# EAGLE design cdf-single-driver (EAGLE 7.3.0)
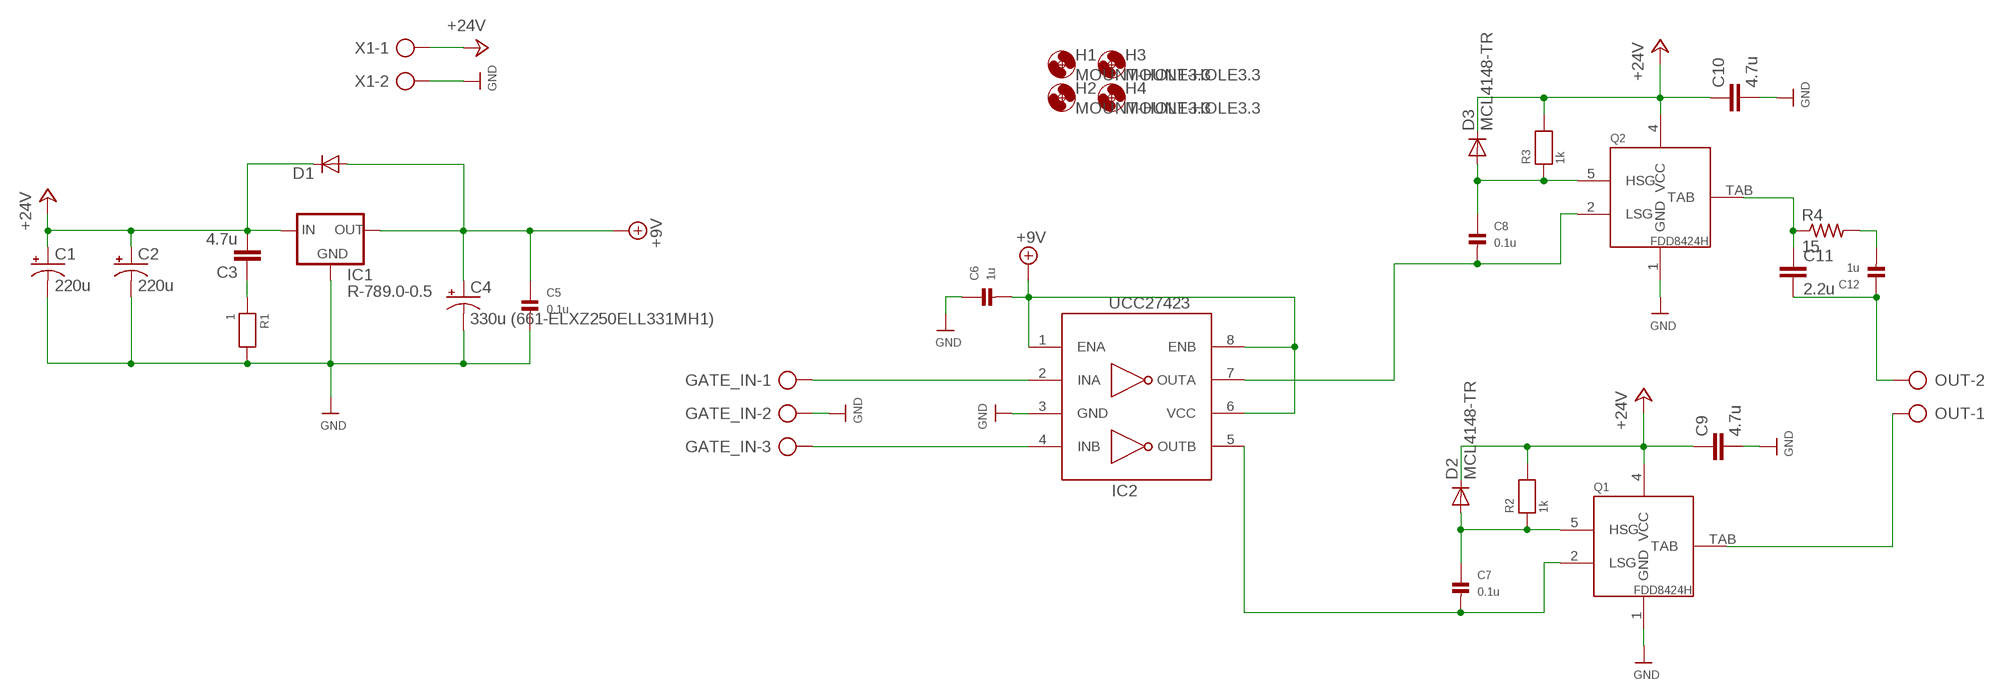
[diagram p0: schematic, sheet 1]

## Parts
C1  220u  CPOL-USE3.5-8  [E3,5-8]
C2  220u  CPOL-USE3.5-8  [E3,5-8]
C3  4.7u  C-EUC1210  [C1210]
C4  330u (661-ELXZ250ELL331MH1)  CPOL-USE3.5-8  [E3,5-8]
C5  0.1u  CAP_CERAMIC0805  [0805]
C6  1u  CAP_CERAMIC1206  [1206]
C7  0.1u  CAP_CERAMIC0805  [0805]
C8  0.1u  CAP_CERAMIC0805  [0805]
C9  4.7u  C-EUC1210  [C1210]
C10  4.7u  C-EUC1210  [C1210]
C11  2.2u  C-EUC1210  [C1210]
C12  1u  CAP_CERAMIC1206  [1206]
D1  DIODE-SOD123  [SOD123]
D2  MCL4148-TR  DIODE-MICROMELF-W  [MICROMELF-W]
D3  MCL4148-TR  DIODE-MICROMELF-W  [MICROMELF-W]
GATE_IN  AK500/3  [AK500/3]
H1  MOUNT-HOLE3.3  [3,3]
H2  MOUNT-HOLE3.3  [3,3]
H3  MOUNT-HOLE3.3  [3,3]
H4  MOUNT-HOLE3.3  [3,3]
IC1  R-789.0-0.5  [SIP3]
IC2  UCC27423  [SOIC8]
OUT  AK500/2  [AK500/2]
Q1  FDD8424H  [TO252-4]
Q2  FDD8424H  [TO252-4]
R1  1  RESISTOR0805  [0805]
R2  1k  RESISTOR0805  [0805]
R3  1k  RESISTOR0805  [0805]
R4  15  R-US_R1210  [R1210]
X1  AK500/2  [AK500/2]

## Nets
+9V: C4.+ C5.1 C6.2 D1.A IC1.3(OUT) IC2.1(ENA) IC2.6(VCC) IC2.8(ENB)
+24V: C1.+ C2.+ C3.2 C9.1 C10.1 D1.C D2.C D3.C IC1.1(IN) Q1.4(VCC) Q2.4(VCC) R2.2 R3.2 X1.1
GND: C1.- C2.- C4.- C5.2 C6.1 C9.2 C10.2 GATE_IN.2 IC1.2(GND) IC2.3(GND) Q1.1(GND) Q2.1(GND) R1.2 X1.2
N$1: GATE_IN.1 IC2.2(INA)
N$2: GATE_IN.3 IC2.4(INB)
N$3: C8.2 IC2.7(OUTA) Q2.2(LSG)
N$4: C8.1 D3.A Q2.5(HSG) R3.1
N$5: C11.1 Q2.TAB R4.1
N$6: C12.2 R4.2
N$7: C11.2 C12.1 OUT.2
N$8: C7.2 IC2.5(OUTB) Q1.2(LSG)
N$9: C7.1 D2.A Q1.5(HSG) R2.1
N$10: OUT.1 Q1.TAB
N$11: C3.1 R1.1

## Library data of the parts
C1 C2 C4 = rcl:CPOL-US: POLARIZED CAPACITOR, American symbol
C3 C9-C11 = rcl:C-EU: CAPACITOR, European symbol
C5-C8 C12 = microbuilder:CAP_CERAMIC: Ceramic Capacitors 0402 - 0402 Surface Mount Capacitors 16pF 50V 5% [Digikey: 445-4899-2-ND] 18pF 50V 5% [Digikey: 490-1281-2-ND] 22pF 50V 5% [Digikey: 490-1283-2-ND] 68pF 50V 5% [Digikey: 490-1289-2-ND] 0.1uF 10V 10% [Digikey: 490-1318-2-ND] 1.0uF 6.3V 10% [Digikey: 490-1320-2-ND] 0603 - 0603 Surface Mount Capacitors 16 pF 50V 5% [Digikey: 445-5051-2-ND] 22 pF 50V [Digikey: PCC220ACVTR-ND] 33 pF 50V 5% [Digikey: 490-1415-1-ND] 56pF 50V 5% [Digikey: 490-1421-1-ND] 220pF 50V 5% [Digikey: 445-1285-1-ND] 680 pF 50V 2200 pF 50V 5% C0G [Digikey: 445-1297-1-ND] 5600 pF 100V 5% X7R [Digikey: 478-3711-1-ND] 0.1 µF 25V 10% [Digikey: PCC2277TR-ND] 0.22 µF 16V 10% X7R [Digikey: 445-1318-1-ND] 1.0 µF 25V 10% [Digikey: 445-5146-2-ND] 0603 - RF Specific 3pF 250V +/-0.1pF RF [Digikey: 712-1347-1-ND] 18 pF 250V 5% [Digikey: 478-3505-1-ND or 712-1322-1-ND] 56 pF 250V 5% C0G RF [Digikey: 490-4867-1-ND] 68 pF 250V RF [Digikey: 490-4868-1-ND] 0805 - 0805 Surface Mount Capacitors 220 pF 250V 2% RF Ceramic Capacitor [Digikey: 712-1398-1-ND] 1000 pF 50V 2% NP0 Ceramic Capacitor [Digikey: 478-3760-1-ND] 0.1 µF 25V 10% Ceramic Capacitor [Digikey: PCC1828TR-ND] 1.0 µF 16V 10% Ceramic Capacitor[Digikey: 490-1691-2-ND] 10.0 µF 10V 10% Ceramic Capacitor[Digikey: 709-1228-1-ND] 10.0 uF 16V 10% Ceramic Capacitor [Digikey: 478-5165-2-ND] 47 uF 6.3V 20% Ceramic Capacitor [Digikey: 587-1779-1-ND or 399-5506-1-ND] 1206 - 1206 Surface Mount Capacitors 47uF 10V 20% Ceramic Capacitor [Digikey: 490-5528-1-ND or 399-5508-1-ND or 445-6010-1-ND] 100uF 6.3V -20%, +80% Y5V Ceramic Capacitor (Digikey: 490-4512-1-ND, Mouser: 81-GRM31CF50J107ZE1L)
D1-D3 = diode:DIODE-: DIODE
GATE_IN = con-ptr500:AK500/3: CONNECTOR; OC_FARNELL: unknown; OC_NEWARK: unknown
H1-H4 = holes:MOUNT-HOLE: MOUNTING HOLE with drill center marker
IC1 = r-78xx_10:R-78*-0.5: Innoline R-78xx-0.5 Series Switching Regulators - 0.5A, Standard Source: http://www.recom-international.com/pdf/Innoline/R-78xx-0.5.pdf; MF: Recom; MPN: R-789.0-05; OC_FARNELL: 1793145; OC_NEWARK: 62X9544
IC2 = keves:UCC27423
OUT X1 = con-ptr500:AK500/2: CONNECTOR; OC_FARNELL: unknown; OC_NEWARK: unknown
Q1 Q2 = keves:FDD8424H
R1-R3 = microbuilder:RESISTOR: Resistors 0402 - 0402 Surface Mount Package 22 Ohm 1% 1/16W [Digikey: 311-22.0LRTR-ND] 33 Ohm 5% 1/16W 1.0K 5% 1/16W 1.5K 5% 1/16W 2.0K 1% 1/16W 10.0K 1% 1/16W [Digikey: 311-10.0KLRTR-ND] 10.0K 5% 1/16W [Digikey: RMCF0402JT10K0TR-ND] 12.1K 1% 1/16W [Digikey: 311-22.0LRTR-ND] 100.0K 5% 1/16W 0603 - 0603 Surface Mount Package 0 Ohm 1/10 Watt 1% Resistor 15 Ohm 1/10 Watt 1% Resistor 33 Ohm 1/10 Watt 1% Resistor 49.9 Ohm 1/10 Watt 1% Resistor 100 Ohm 1/10 Watt 1% Resistor 150 Ohm 1/10 Watt 1% Resistor 240 Ohm 1/10 Watt 1% Resistor 390 Ohm 1/10 Watt 1% Resistor 560 Ohm 1/10 Watt 1% Resistor 680 Ohm 1/10 Watt 1% Resistor 750 Ohm 1/10 Watt 1% Resistor 1.0K Ohm 1/10 Watt 1% Resistor 1.5K Ohm 1/10 Watt 1% Resistor 2.0K Ohm 1/10 Watt 1% Resistor 2.2K Ohm 1/10 Watt 1% Resistor 3.3K Ohm 1/10 Watt 1% Resistor 4.7K Ohm 1/10 Watt 1% Resistor 10.0K Ohm 1/10 Watt 1% Resistor 12.0K Ohm 1/10 Watt 1% Resistor 12.1K Ohm 1/10 Watt 1% Resistor 20.0K Ohm 1/10 Watt 1% Resistor 33.0K Ohm 1/10 Watt 1% Resistor 100.0K Ohm 1/10 Watt 1% Resistor 0805 - 0805 Surface Mount Package 0 Ohm 1/8 Watt 1% Resistor 33 Ohm 1/8 Watt 1% Resistor 100 Ohm 1/8 Watt 1% Resistor 150 Ohm 1/8 Watt 1% Resistor 200 Ohm 1/8 Watt 1% Resistor 240 Ohm 1/8 Watt 1% Resistor 330 Ohm 1/8 Watt 1% Resistor 390 Ohm 1/8 Watt 1% Resistor 470 Ohm 1/8 Watt 1% Resistor 1.0K Ohm 1/8 Watt 1% Resistor 1.5K Ohm 1/8 Watt 1% Resistor 2.0K Ohm 1/8 Watt 1% Resistor 4.7K Ohm 1/8 Watt 1% Resistor 5.1K Ohm 1/8 Watt 1% Resistor 5.6K Ohm 1/8 Watt 1% Resistor 10.0K Ohm 1/8 Watt 1% Resistor 22.0K Ohm 1/8 Watt 1% Resistor 33.0K Ohm 1/8 Watt 1% Resistor 100K Ohm 1/8 Watt 1% Resistor 1206 - 1206 Surface Mount Package 2012 - 2010 Surface Mount Package 0.11 Ohm 1/2 Watt 1% Resistor - Digikey: RHM.11UCT-ND
R4 = rcl:R-US_: RESISTOR, American symbol

## Board
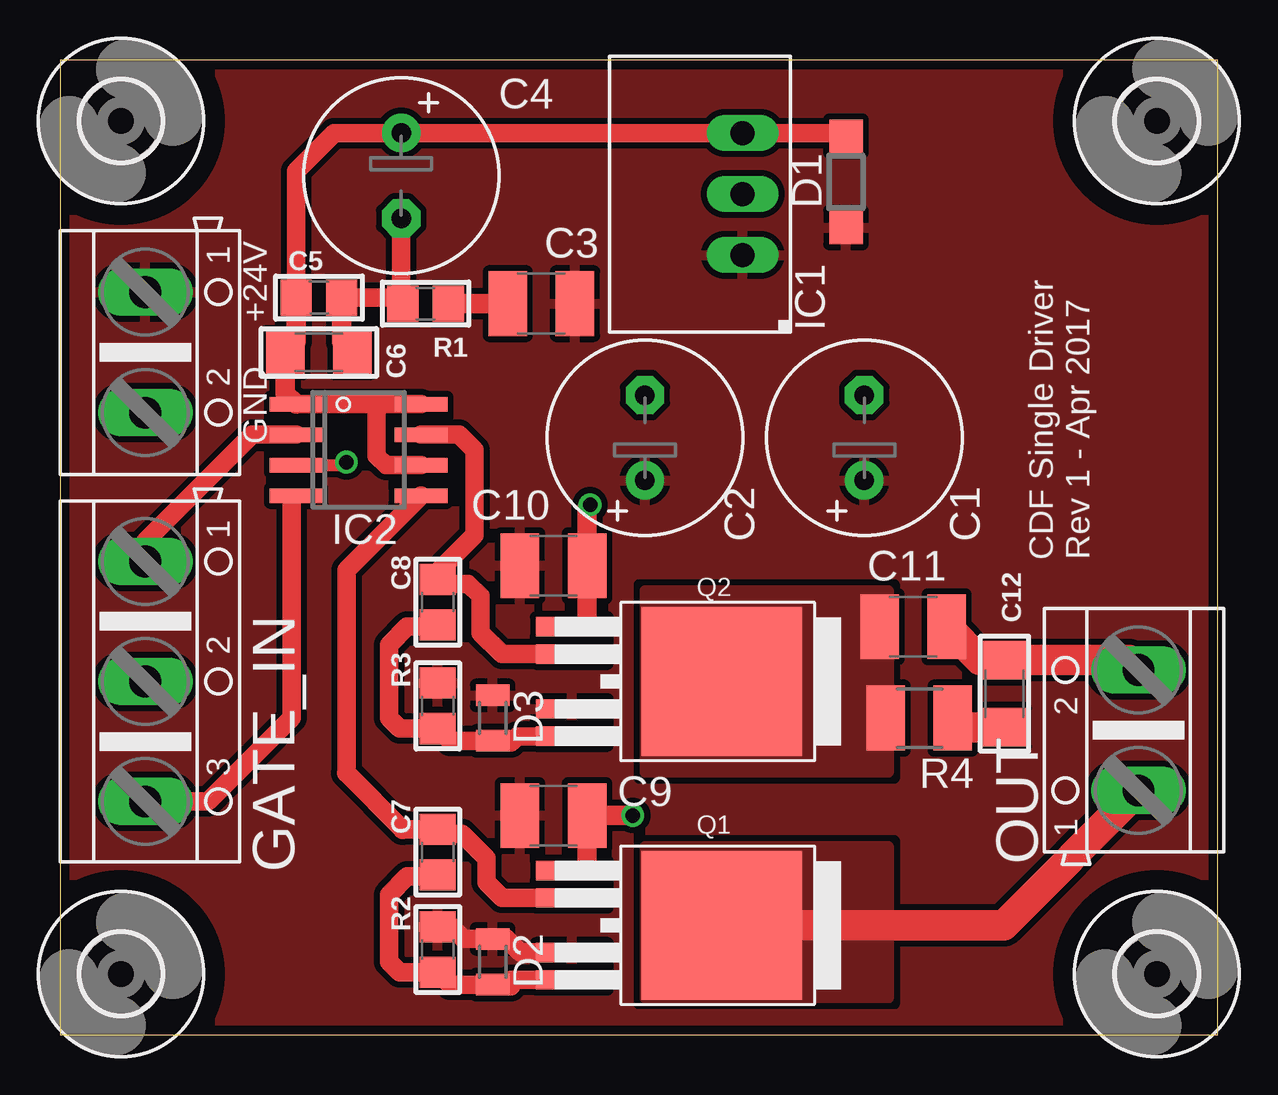
[diagram p1: board, top side]
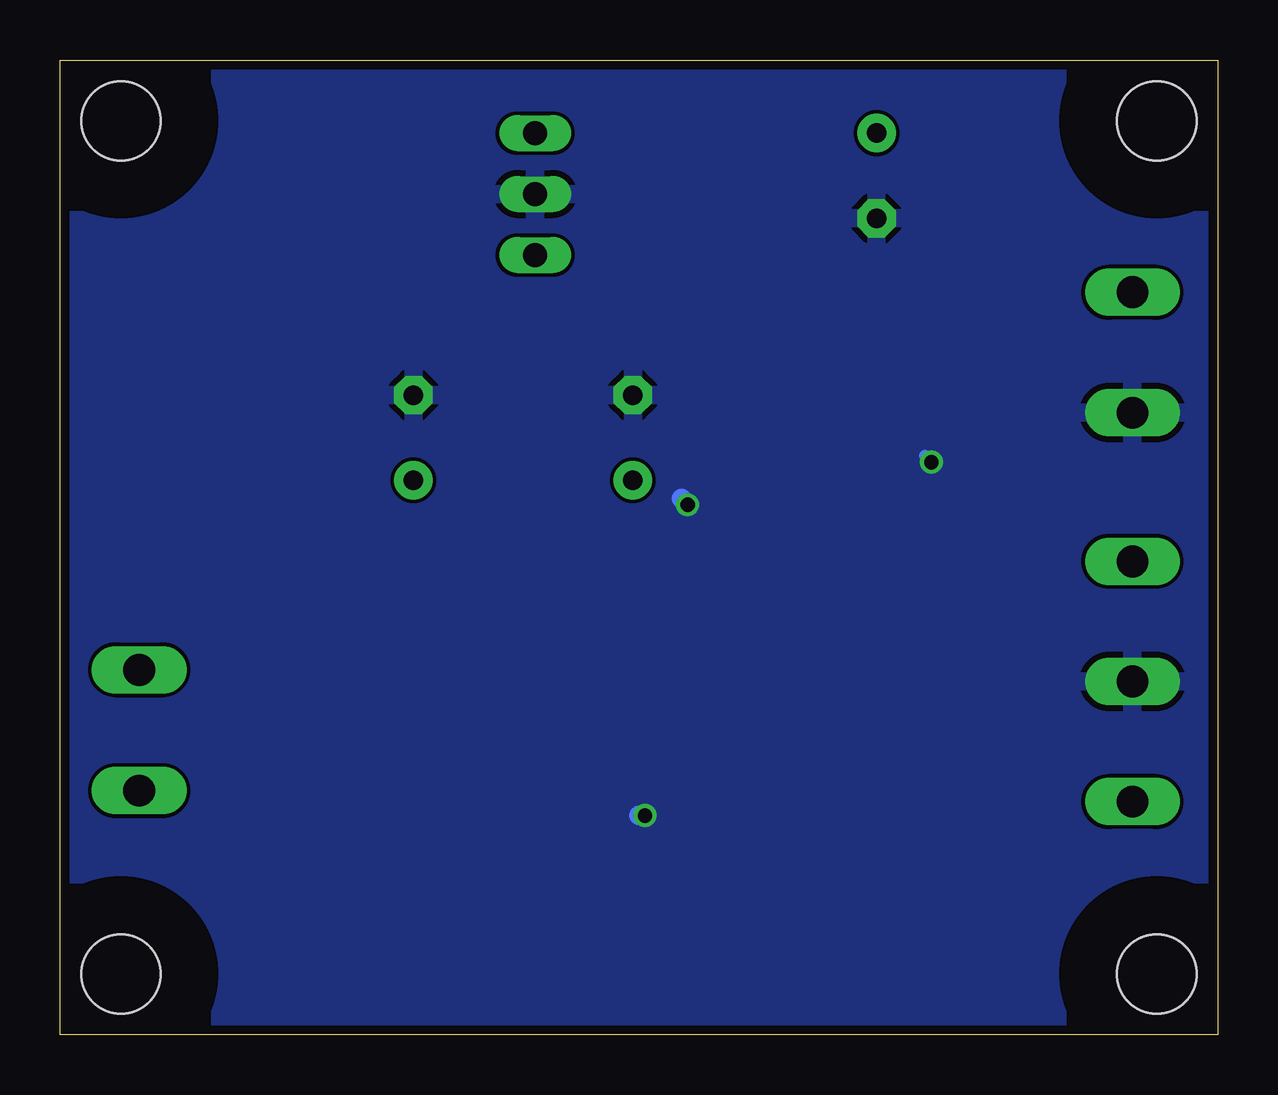
[diagram p2: board, bottom side, seen from below]

Size 48.26 x 40.64 mm. Coordinates in mm from the lower left corner, seen from the top.
Outline: 0,0 48.26,0 48.26,40.64 0,40.64 0,0
Copper layers (1*16): Top 0.0356mm / dielectric 1.5011mm / Bottom 0.0356mm
Design rules "oshpark *": minimum track width 6mil, minimum drill 13mil, track to track 6mil, track to pad 6mil, pad to pad 6mil, via to via 6mil, smd to smd 6mil, copper to edge 15mil, drill to drill 6mil, minimum pad ring 7mil, minimum via ring 7mil, stop-mask expansion 3mil, vias tented up to drill 0mil, thermal gap 10mil

### Footprints (pad centres in the part's own frame; a part is rotated, then mirrored left to right if it is on the bottom)
E3,5-8 = drill 0.813 pad 1.6: + -1.778,0 | drill 0.813 pad 1.6 octagon: - 1.778,0
C1210 = smd 1.6 x 2.7: 1 -1.4,0; 2 1.4,0
0805 = smd 1.3 x 1.5: 1 -0.95,0; 2 0.95,0
1206 = smd 1.6 x 1.8: 1 -1.4,0; 2 1.4,0
SOD123 = smd 1.4 x 1.4: A 1.9,0; C -1.9,0
MICROMELF-W = smd 0.9 x 1.4: A 0.95,0; C -0.95,0
AK500/3 = drill 1.321 long: 1 -5.004,0; 2 0,0; 3 5.004,0
3,3 = hole 3.3: 0,0
SIP3 = drill 1 long: 1 -2.54,0; 2 0,0; 3 2.54,0
SOIC8 = smd 0.6 x 2.2: 1 -1.905,-2.6; 2 -0.635,-2.6; 3 0.635,-2.6; 4 1.905,-2.6; 5 1.905,2.6; 6 0.635,2.6; 7 -0.635,2.6; 8 -1.905,2.6
AK500/2 = drill 1.321 long: 1 -2.515,0; 2 2.515,0
TO252-4 = smd 0.8 x 3: 1 -2.28,0; 2 -1.14,0; 4 1.14,0; 5 2.28,0 | smd 6.2 x 6.7: TAB 0,6.25
R1210 = smd 1.6 x 2.7: 1 -1.4,0; 2 1.4,0

### Placement (x,y rotation side)
C1  33.53,24.89 90 top
C2  24.38,24.89 90 top
C3  20.07,30.48 0 top
C4  14.22,35.81 270 top
C5  10.79,30.73 0 top
C6  10.79,28.45 180 top
C7  15.75,7.62 90 top
C8  15.75,18.03 90 top
C9  20.57,9.14 0 top
C10  20.57,19.56 0 top
C11  35.56,17.02 0 top
C12  39.37,14.22 270 top
D1  32.77,35.56 90 top
D2  18.03,3.05 270 top
D3  18.03,13.21 270 top
GATE_IN  3.56,14.73 270 top
H1  45.72,38.1 0 top
H2  45.72,2.54 0 top
H3  2.54,38.1 0 top
H4  2.54,2.54 0 top
IC1  28.45,35.05 90 top
IC2  12.45,24.38 270 top
OUT  44.96,12.7 90 top
Q1  21.34,4.57 270 top
Q2  21.34,14.73 270 top
R1  15.24,30.48 180 top
R2  15.75,3.56 90 top
R3  15.75,13.72 90 top
R4  35.81,13.21 0 top
X1  3.56,28.45 270 top

### Tracks (layer width: path | path; a pad name or v marks a point on that pad's centre or on a via)
+9V
  Top 0.508: 13.21,26.04 12.95,26.29 | IC2.1
  Top 0.762: IC2.6 13.59,23.75 13.21,24.13 13.21,26.04 | IC2.1 12.95,26.29 IC2.8 | C5.1 9.85,36.01 11.43,37.59 C4.+ IC1.3 32.63,37.59 D1.A
  Top 0.813: IC2.1 9.39,26.74 C6.2 9.85,28.9 C5.1
+24V
  Top 0.762: Q1.4 19.17,3.43 18.54,4.06 18.1,4.06 D2.C 16.83,4 16.26,4.57 15.81,4.57 R2.2
  pour Top (isolate 0.254, rank 6): -3.05,50.8 53.34,50.8 53.34,-5.33 -3.05,-5.33
GND  (via drill 0.6)
  Top 0.508: IC2.3 11.81,23.75 v11.94,23.88
  Top 0.762: C4.- 14.22,30.99 | 14.22,30.99 14.22,30.55 R1.2 | C5.2 13.97,30.73 14.22,30.99
  Top 0.813: C5.2 11.74,28.9 C6.1 | Q2.1 21.84,17.02 21.97,17.15 C10.2 21.97,21.97 v22.1,22.1 | Q1.1 22.1,6.86 21.97,6.98 C9.2 v23.88,9.14
  Bottom 0.508: v11.94,23.88 12.19,24.13
  Bottom 0.813: v22.1,22.1 22.35,22.35 | v23.88,9.14 24.13,9.14
  pour Bottom: -16,48.26 50.8,48.26 50.8,-3.56 -16,-3.56
N$1
  Top 0.762: GATE_IN.1 3.56,20.57 8,25.02 IC2.2
N$2
  Top 0.508: 9.65,22.29 IC2.4
  Top 0.762: GATE_IN.3 6.17,9.73 9.65,13.21 9.65,22.29
N$3
  Top 0.762: Q2.2 18.42,15.87 17.53,16.76 17.53,18.29 17.02,18.8 15.94,18.8 C8.2 15.75,19.3 17.27,20.83 17.27,24.38 16.64,25.02 IC2.7
N$4
  Top 0.762: Q2.5 19.06,12.45 18.8,12.19 18.1,12.19 D3.A 16.26,12.26 R3.1 14.16,12.77 13.72,13.21 13.72,16.26 14.48,17.02 15.68,17.02 C8.1
N$5
  pour Top (isolate 0.254, rank 2, no thermals): 24.38,18.54 34.54,18.54 34.54,10.92 24.38,10.92
N$6
  Top 1.27: C12.2 37.6,12.82 R4.2
N$7
  Top 1.27: C11.2 38.35,15.62 C12.1 44.55,15.62 OUT.2
N$8
  Top 0.762: Q1.2 18.42,5.71 17.78,6.35 17.78,7.37 16.76,8.38 15.94,8.38 C7.2 14.29,8.57 | 11.94,10.92 11.94,19.37 IC2.5
  Top 0.813: 14.29,8.57 11.94,10.92
N$9
  Top 0.762: Q1.5 18.8,2.29 18.8,2.03 18.03,2.03 D2.A 16.26,2.1 R2.1 14.16,2.61 13.72,3.05 13.72,5.84 14.48,6.6 15.68,6.6 C7.1
N$10
  Top 1.27: 27.59,3.83 Q1.TAB 39.34,4.57 OUT.1
  pour Top (isolate 0.254, rank 2, no thermals): 24.38,7.87 34.54,7.87 34.54,1.52 24.38,1.52
N$11
  Top 0.813: R1.1 C3.1

### Text on the board
tNames: +24V | GND | CDF Single Driver | Rev 1 - Apr 2017